# EAGLE design Power 5V-4A, 12V-1A (EAGLE 9.4.2)
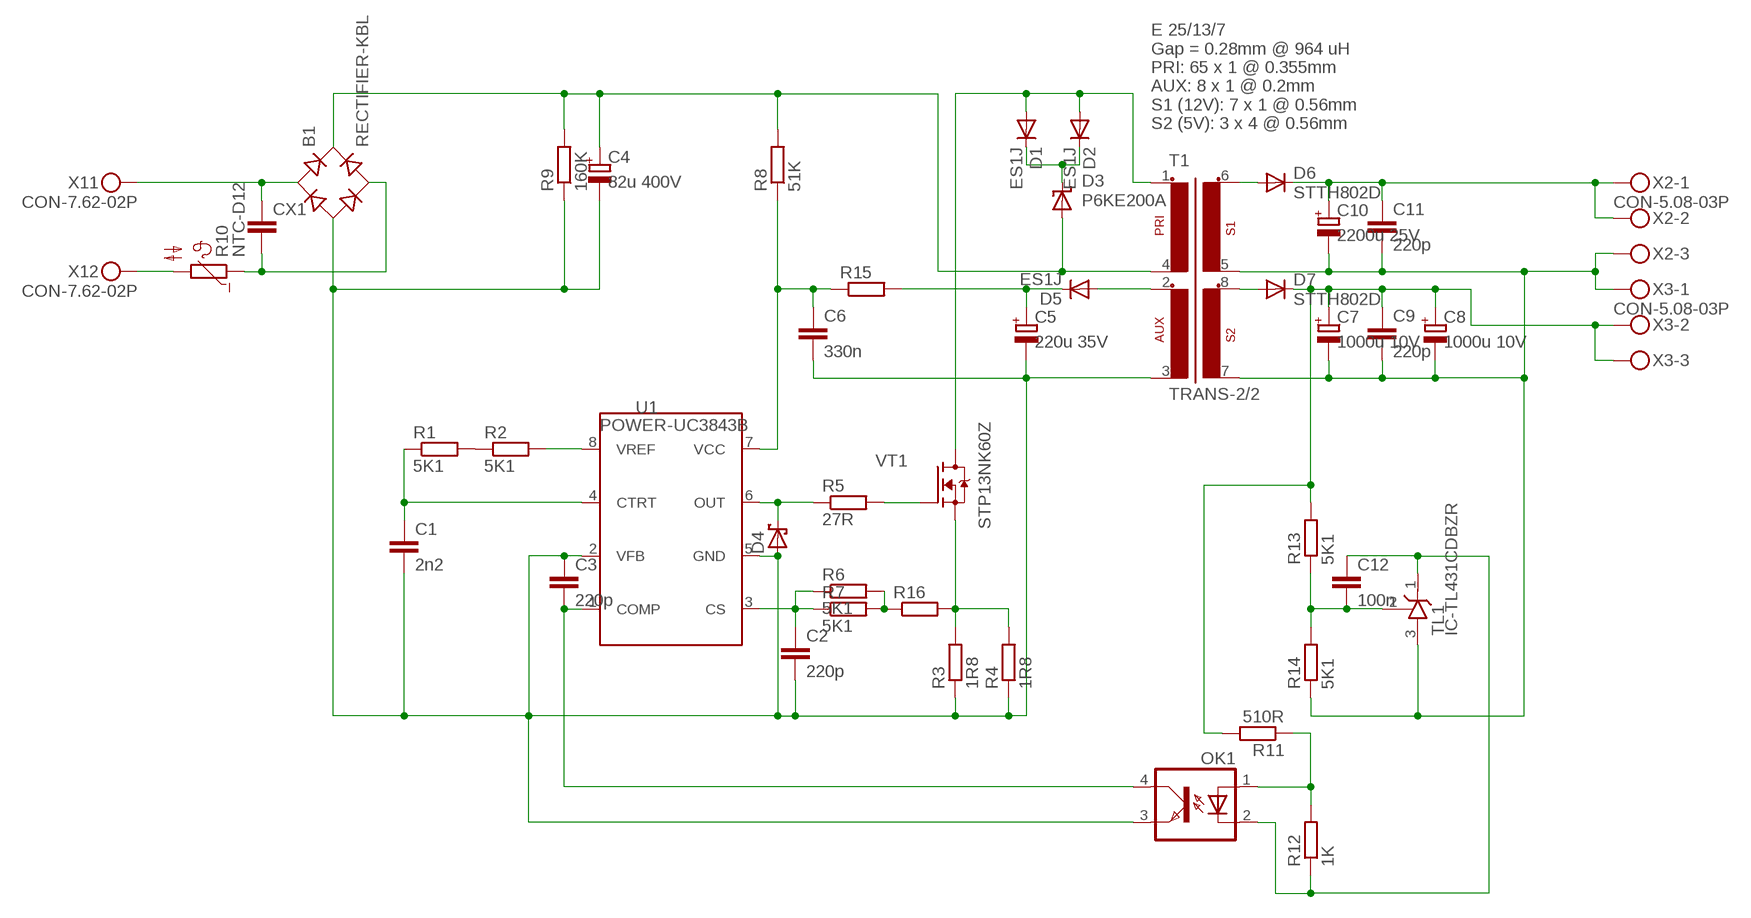
[diagram p0: schematic, sheet 1]

## Parts
B1  RECTIFIER-KBL  [KBL]
C1  2n2  CAP_0603  [CAP0603]
C2  220p  CAP_1206  [CAP1206]
C3  220p  CAP_1206  [CAP1206]
C4  82u 400V  CAP-POL_E25-10-C  [C_D25-G10-CLAMP]
C5  220u 35V  CAP-POL_E3.5-8  [E3,5-8]
C6  330n  CAP_1206  [CAP1206]
C7  1000u 10V  CAP-POL_E5-10.5  [E5-10,5]
C8  1000u 10V  CAP-POL_E5-10.5  [E5-10,5]
C9  220p  CAP_1206  [CAP1206]
C10  2200u 25V  CAP-POL_E5-10.5  [E5-10,5]
C11  220p  CAP_1206  [CAP1206]
C12  100n  CAP_0805  [CAP0805]
CX1  CXXC15B6  [XC15B6]
D1  ES1J  DIODE_ES1J  [DO214AC]
D2  ES1J  DIODE_ES1J  [DO214AC]
D3  P6KE200A  SUPRESSORDO-204AC  [DO15-12]
D4  DIODE-SH_SMA  [DO214AC]
D5  ES1J  DIODE_ES1J  [DO214AC]
D6  STTH802D  DIODE_TO-220-2  [TO220ACS]
D7  STTH802D  DIODE_TO-220-2  [TO220ACS]
OK1  OPTOTRANSPC817  [DIL04]
R1  5K1  R_R0603  [RESC1508X50]
R2  5K1  R_R0603  [RESC1508X50]
R3  1R8  R_MF-025  [MF-025]
R4  1R8  R_MF-025  [MF-025]
R5  27R  R_R1206  [RESC3216X60]
R6  5K1  R_R0603  [RESC1508X50]
R7  5K1  R_R0603  [RESC1508X50]
R8  51K  R_MF-1  [MF-1]
R9  160K  R_MF-0125  [MF-0125]
R10  NTC-D12  [NTC-D12]
R11  510R  R_R0805  [RESC2012X50]
R12  1K  R_R0805  [RESC2012X50]
R13  5K1  R_R0603  [RESC1508X50]
R14  5K1  R_R0603  [RESC1508X50]
R15  R_R0805  [RESC2012X50]
R16  R_R0805  [RESC2012X50]
T1  TRANS-2/2  [EE25_8PIN_HORIZ]
TL1  IC-TL431CDBZR  [SOT95P240X115-3]
U1  POWER-UC3843B  [DIP-8]
VT1  STP13NK60Z  FET-NTO-220  [TO-220V]
X1  CON-7.62-02P  [KF25C-7.62-02P-13]
X2  CON-5.08-03P  [MKDSN1,5/3-5,08]
X3  CON-5.08-03P  [MKDSN1,5/3-5,08]

## Nets
N$1: R1.2 R2.1
N$2: C1.1 R1.1 U1.4(CTRT)
N$3: B1.- C1.2 C2.2 C3.1 C4.- C5.- C6.2 D4.A OK1.3(EMIT) R3.1 R4.1 R9.1 T1.3(AUX-2) U1.2(VFB) U1.5(GND)
N$4: R3.2 R4.2 R16.2 VT1.3(S)
N$5: D1.A D2.A T1.1(P1-1) VT1.2(D)
N$6: B1.+ C4.+ D3.A R8.2 R9.2 T1.4(P1-2)
N$7: D1.C D2.C D3.C
N$8: D4.C R5.1 U1.6(OUT)
N$9: R5.2 VT1.1(G)
N$10: C2.1 R6.1 R7.1 U1.3(CS)
N$11: C3.2 OK1.4(COL) U1.1(COMP)
N$12: C6.1 R8.1 R15.1 U1.7(VCC)
N$13: B1.AC2 CX1.2 R10.1
N$14: D5.A T1.2(AUX-1)
N$15: B1.AC1 CX1.1 X1.P$1
N$16: R10.2 X1.P$2
N$17: D7.A T1.8(S2-1)
N$18: C7.+ C8.+ C9.1 D7.C R11.2 R13.2 X3.2 X3.3
N$19: C5.+ D5.C R15.2
N$20: C7.- C8.- C9.2 C10.- C11.2 R14.1 T1.5(S1-2) T1.7(S2-2) TL1.3(A) X2.3 X3.1
N$21: C10.+ C11.1 D6.C X2.1 X2.2
N$22: D6.A T1.6(S1-1)
N$23: C12.1 OK1.2(C) R12.1 TL1.1(C)
N$24: OK1.1(A) R11.1 R12.2
N$25: C12.2 R13.1 R14.2 TL1.2(R)
N$26: R6.2 R7.2 R16.1
VREF: R2.2 U1.8(VREF)

## Notes on the sheet
- E 25/13/7
  Gap = 0.28mm @ 964 uH
  PRI: 65 x 1 @ 0.355mm
  AUX: 8 x 1 @ 0.2mm
  S1 (12V): 7 x 1 @ 0.56mm
  S2 (5V): 3 x 4 @ 0.56mm

## Library data of the parts
B1 = rectifier:RECTIFIER-: Rectifier
C1-C3 C6 C9 C11 C12 = Flamberm:CAP_
C4 C5 C7 C8 C10 = Flamberm:CAP-POL_
CX1 = rcl:CX: X CAPACITOR for power line; SPICEPREFIX: C
D1 D2 D5-D7 = Flamberm:DIODE_
D3 = Flamberm:SUPRESSOR
D4 = Flamberm:DIODE-SH_
OK1 = Flamberm:OPTOTRANS: SHARP OPTO COUPLER; MPN: PC817X4J000F; OC_FARNELL: 9707727; OC_NEWARK: 97K7059
R1-R9 R11-R16 = Flamberm:R_
R10 = Flamberm:NTC-D12
T1 = Flamberm:TRANS-2/2
TL1 = Flamberm:IC-TL431
U1 = Flamberm:POWER-UC3843B
VT1 = Flamberm:FET-N
X1 = Flamberm:CON-7.62-02P
X2 X3 = Flamberm:CON-5.08-03P: MKDSN 1,5/ 3-5,08 Printklemme Nennstrom: 13,5 A Nennspannung: 250 V Rastermaß: 5,08 mm Polzahl: 3 Anschlussart: Schraubanschluss Montage: Löten Anschlussrichtung Leiter/Platine: 0 ° Artikelnummer: 1729131 Source: http://eshop.phoenixcontact.com .. 1729131.pdf

## Board
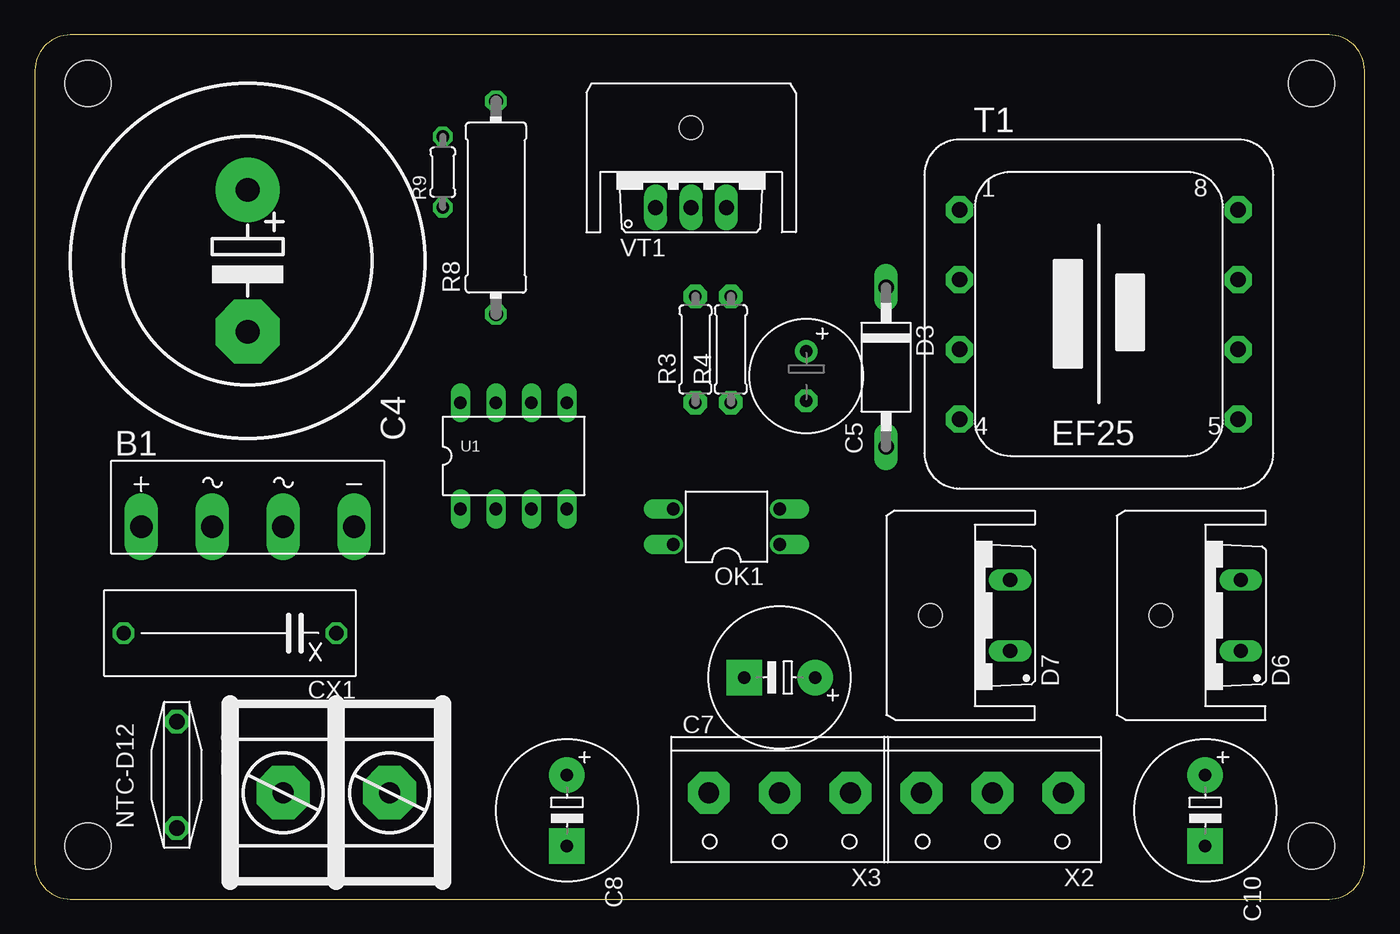
[diagram p1: board, top side]
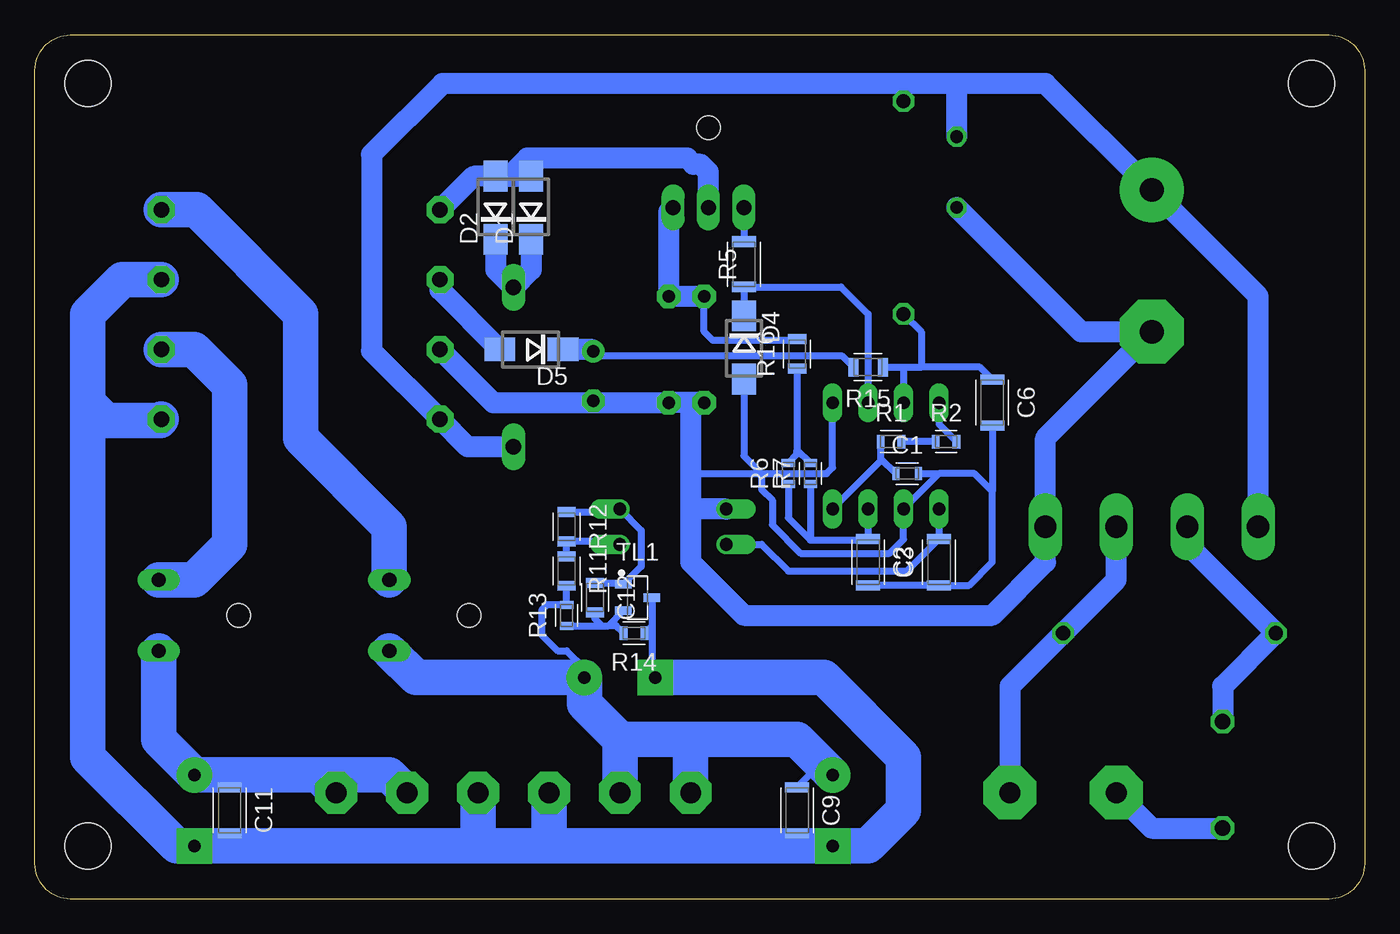
[diagram p2: board, bottom side, seen from below]

Size 95.23 x 61.9 mm. Coordinates in mm from the lower left corner, seen from the top.
Outline: 92.69,61.9 2.54,61.9 arc90 0,59.36 0,2.54 arc90 2.54,0 92.69,0 arc90 95.23,2.54 95.23,59.36 arc90 92.69,61.9
Copper layers (1*16): Top 0.035mm / dielectric 1.5mm / Bottom 0.035mm
Design rules "default": minimum track width 6mil, minimum drill 0.35mm, track to track 6mil, track to pad 6mil, pad to pad 6mil, via to via 6mil, smd to smd 6mil, copper to edge 40mil, drill to drill 6mil, minimum pad ring 10mil, minimum via ring 8mil, stop-mask expansion 4mil, vias tented up to drill 0mil, thermal gap 10mil
Holes 3.3 mm at 3.81,58.42 91.44,58.42 91.44,3.81 3.81,3.81

### Footprints (pad centres in the part's own frame; a part is rotated, then mirrored left to right if it is on the bottom)
KBL = drill 1.6 long: + -7.62,-1.27; - 7.62,-1.27; AC1 2.54,-1.27; AC2 -2.54,-1.27
CAP0603 = smd 0.512 x 0.912: 1 -0.8,0; 2 0.8,0
CAP1206 = smd 0.712 x 1.712: 1 -1.65,0; 2 1.65,0
C_D25-G10-CLAMP = drill 1.7 pad 4.597: + -5.08,0 | drill 1.7 pad 4.597 octagon: - 5.08,0
E3,5-8 = drill 0.9 pad 1.6: + -1.778,0 | drill 0.9 pad 1.6 octagon: - 1.778,0
E5-10,5 = drill 0.9 pad 2.54: + -2.54,0 | drill 0.9 pad 2.54 square: - 2.54,0
CAP0805 = smd 0.712 x 1.312: 1 -1.05,0; 2 1.05,0
XC15B6 = drill 1.016 octagon: 1 -7.62,0; 2 7.62,0
DO214AC = smd 2.2 x 1.7: A 2.25,0; C -2.285,0
DO15-12 = drill 1.1 pad 1.676 long: A 5.08,0; C -6.35,0
TO220ACS = drill 1.016 long: A 2.54,-2.54; C -2.54,-2.54
DIL04 = drill 0.9 pad 1.27 offset: 1 -1.27,-3.81; 2 1.27,-3.81; 3 1.27,3.81; 4 -1.27,3.81
RESC1508X50 = smd 0.562 x 0.962: 1 -0.75,0; 2 0.75,0
MF-025 = drill 0.9 pad 1.676 octagon: 1 -3.81,0; 2 3.81,0
RESC3216X60 = smd 0.762 x 1.712: 1 -1.625,0; 2 1.625,0
MF-1 = drill 1.016 octagon: 1 -7.62,0; 2 7.62,0
MF-0125 = drill 0.9 octagon: 1 -2.54,0; 2 2.54,0
NTC-D12 = drill 1.1 pad 1.676 octagon: 1 -3.81,0; 2 3.81,0
RESC2012X50 = smd 0.712 x 1.312: 1 -1.05,0; 2 1.05,0
EE25_8PIN_HORIZ = drill 1.1 pad 1.93 octagon: 1 -9.98,7.46; 2 -9.98,2.46; 3 -9.98,-2.54; 4 -9.98,-7.54; 5 9.98,-7.54; 6 9.98,-2.54; 7 9.98,2.46; 8 9.98,7.46
SOT95P240X115-3 = smd 1.18 x 0.609: 1 -1.024,0.95; 2 -1.024,-0.95; 3 1.024,0
DIP-8 = drill 0.9 long: 1 -3.81,-3.81; 2 -1.27,-3.81; 3 1.27,-3.81; 4 3.81,-3.81; 5 3.81,3.81; 6 1.27,3.81; 7 -1.27,3.81; 8 -3.81,3.81
SK95-3M3_HOLE = hole 1.7: 0,3.175
TO-220V = drill 1.1 long: 1 -2.54,-2.54; 2 0,-2.54; 3 2.54,-2.54
KF25C-7.62-02P-13 = drill 1.5 pad 3.81 octagon: P$1 -3.81,0; P$2 3.81,0
MKDSN1,5/3-5,08 = drill 1.5 pad 3 octagon: 1 -5.08,0; 2 0,0; 3 5.08,0

### Placement (x,y rotation side)
B1  15.24,27.94 0 top
C1  32.77,30.48 0 bottom
C2  35.56,24.13 270 bottom
C3  30.48,24.13 90 bottom
C4  15.24,45.72 270 top
C5  55.24,37.47 270 top
C6  26.67,35.56 270 bottom
C7  53.34,15.88 180 top
C8  38.1,6.35 270 top
C9  40.64,6.35 270 bottom
C10  83.82,6.35 270 top
C11  81.28,6.35 270 bottom
C12  55.12,21.59 270 bottom
CX1  13.97,19.05 180 top
D1  59.69,49.53 90 bottom
D2  62.23,49.53 90 bottom
D3  60.96,37.47 270 top
D4  44.45,39.5 270 bottom
D5  59.69,39.37 180 bottom
D6  83.82,20.32 90 top
D7  67.31,20.32 90 top
OK1  49.53,26.67 90 top
R1  33.91,32.77 0 bottom
R2  29.97,32.77 0 bottom
R3  47.31,39.37 90 top
R4  49.85,39.37 90 top
R5  44.45,45.47 90 bottom
R6  41.27,30.48 90 bottom
R7  39.69,30.48 90 bottom
R8  33.02,49.53 90 top
R9  29.21,52.07 90 top
R10  10.16,8.89 270 top
R11  57.15,23.5 270 bottom
R12  57.15,26.67 270 bottom
R13  57.15,20.32 90 bottom
R14  52.32,19.05 180 bottom
R15  35.56,38.1 180 bottom
R16  40.64,39.05 90 bottom
T1  76.2,41.91 0 top
TL1  52.07,21.59 0 bottom
U1  34.29,31.75 0 top
U$1  [SK95-3M3_HOLE]  46.99,52.07 0 top
U$2  [SK95-3M3_HOLE]  67.31,20.32 90 top
U$3  [SK95-3M3_HOLE]  83.82,20.32 90 top
VT1  46.99,52.07 0 top
X1  21.59,7.62 180 top
X2  68.58,7.62 180 top
X3  53.34,7.62 180 top

### Tracks (layer width: path | path; a pad name or v marks a point on that pad's centre or on a via)
N$1
  Bottom 0.508: R2.1 R1.2
N$2
  Bottom 0.508: R1.1 34.66,31.75 34.66,31.57 | 34.66,31.57 34.66,31.38 U1.4 | 34.66,31.57 C1.1
N$3
  Bottom 0.508: 48.26,30.48 43.18,30.48 | D4.A 44.45,31.75 43.18,30.48 | C2.2 C3.1 28.32,22.48 26.67,24.13 26.67,29.21 | U1.5 38.1,30.9 38.52,30.48 43.18,30.48 | 43.18,30.48 43.18,29.34 42.42,28.57 42.42,26.8 40.39,24.77 34.02,24.77 33.02,25.77 U1.2 30.48,30.48 | 26.67,29.21 27.94,30.48 30.48,30.48 | C1.2 30.48,30.48 | C6.2 26.67,29.21
  Bottom 1.5: T1.3 62.41,35.56 55.37,35.56 C5.- 55.12,35.56 R4.1 48.26,35.56 | R3.1 48.26,35.56 | 48.26,35.56 48.26,30.48 48.26,27.94 | 48.26,27.94 48.26,24.13 44.45,20.32 26.67,20.32 22.86,24.13 B1.- 22.86,33.02 C4.- 20.32,40.64 R9.1 | OK1.3 48.26,27.94
N$4
  Bottom 0.508: R16.2 40.74,40.01 46.67,40.01 47.31,40.64 R3.2
  Bottom 1.5: VT1.3 49.85,49.21 R4.2 R3.2
N$5
  Bottom 1.5: 60.96,51.78 D2.A 63.81,51.78 T1.1 | 60.96,51.78 D1.A | VT1.2 46.99,52.07 47.55,52.63 48.07,52.63 48.52,53.08 59.95,53.08 60.96,52.07 60.96,51.78
N$6
  Bottom 0.508: R8.2 33.02,58.42
  Bottom 1.5: D3.A 64.23,32.38 T1.4 71.12,39.27 71.12,53.34 66.04,58.42 33.02,58.42 29.21,58.42 | 29.21,58.42 22.86,58.42 C4.+ 7.62,43.18 B1.+ | R9.2 29.21,58.42
N$7
  Bottom 1.5: D2.C 62.23,45.09 D3.C 59.69,45.09 D1.C
N$8
  Bottom 0.508: U1.6 35.56,41.91 37.49,43.84 R5.1 D4.C
N$9
  Bottom 0.508: VT1.1 R5.2
N$10
  Bottom 0.508: U1.3 C2.1 35.62,25.72 39.69,25.72 | R6.1 41.27,27.3 39.69,25.72 | R7.1 39.69,25.72
N$11
  Bottom 0.508: OK1.4 43.18,25.4 41.27,23.5 32.77,23.5 C3.2 U1.1
N$12
  Bottom 0.508: R8.1 31.75,40.64 31.75,38.1 | 33.02,38.1 U1.7 | R15.1 33.02,38.1 | 33.02,38.1 31.75,38.1 | C6.1 27.56,38.1 31.75,38.1
N$13
  Bottom 1.5: R10.1 10.16,15.24 CX1.2 12.7,25.4 B1.AC2
N$14
  Bottom 1.5: D5.A 66.22,43.65 T1.2
N$15
  Bottom 1.5: X1.P$1 25.4,15.24 CX1.1 17.78,22.86 B1.AC1
N$16
  Bottom 1.5: X1.P$2 15.24,5.08 R10.2
N$17
  Bottom 2.54: T1.8 83.66,49.37 76.2,41.91 76.2,33.02 69.85,26.67 D7.A
N$18
  Bottom 0.508: R11.2 R13.2 58.56,21.07 58.93,20.7 58.93,18.92 57.78,17.78 57.15,17.78 55.88,16.51 C7.+ | C9.1 39.75,8.89 C8.+
  Bottom 2.54: D7.C 67.94,15.88 C7.+ 55.88,13.97 53.34,11.43 | 53.34,11.43 48.26,11.43 | 48.26,11.43 40.64,11.43 C8.+ | 53.34,11.43 X3.2 | X3.3 48.26,11.43
N$19
  Bottom 0.508: R15.2 37.44,38.92 54.93,38.92 C5.+ 55.37,39.37
  Bottom 1.5: 55.37,39.37 D5.C
N$20
  Bottom 0.508: TL1.3 51.05,19.58 | 51.05,19.58 R14.1 | 51.05,19.58 51.05,16.12 C7.- | C9.2 40.64,3.81 | C11.2 81.28,3.81
  Bottom 2.54: T1.7 88.98,44.37 91.44,41.91 91.44,35.56 | 91.44,35.56 90.17,34.29 86.26,34.29 T1.5 | 91.44,35.56 91.44,10.16 85.09,3.81 C10.- 81.28,3.81 63.5,3.81 | 63.5,3.81 58.42,3.81 | 58.42,3.81 40.64,3.81 C8.- 35.56,3.81 33.02,6.35 33.02,10.16 38.73,15.88 C7.- | X2.3 63.5,3.81 | X3.1 58.42,3.81
N$21
  Bottom 0.508: C11.1 81.28,8.89
  Bottom 2.54: D6.C 86.36,11.43 C10.+ 81.28,8.89 74.93,8.89 | 74.93,8.89 X2.1 | X2.2 69.85,8.89 74.93,8.89
N$22
  Bottom 2.54: T1.6 83.82,39.37 81.28,36.83 81.28,25.4 83.82,22.86 D6.A
N$23
  Bottom 0.508: R12.1 53.56,27.72 OK1.2 51.82,26.42 51.82,23.82 TL1.1 53.19,22.64 C12.1
N$24
  Bottom 0.508: OK1.1 53.56,25.62 R12.2 R11.1
N$25
  Bottom 0.508: R13.1 54.61,19.57 | 54.61,19.57 54.16,19.57 | 54.16,19.57 TL1.2 | C12.2 55.12,20.08 54.61,19.57 | R14.2 53.59,19.57 54.16,19.57
N$26
  Bottom 0.508: R7.2 40.64,32.18 | R16.1 40.64,32.18 | R6.2 40.64,31.86 40.64,32.18
VREF
  Bottom 0.508: R2.2 30.48,34.02 U1.8